# EAGLE schematic SBC_rev 3 (EAGLE 8.5.0)
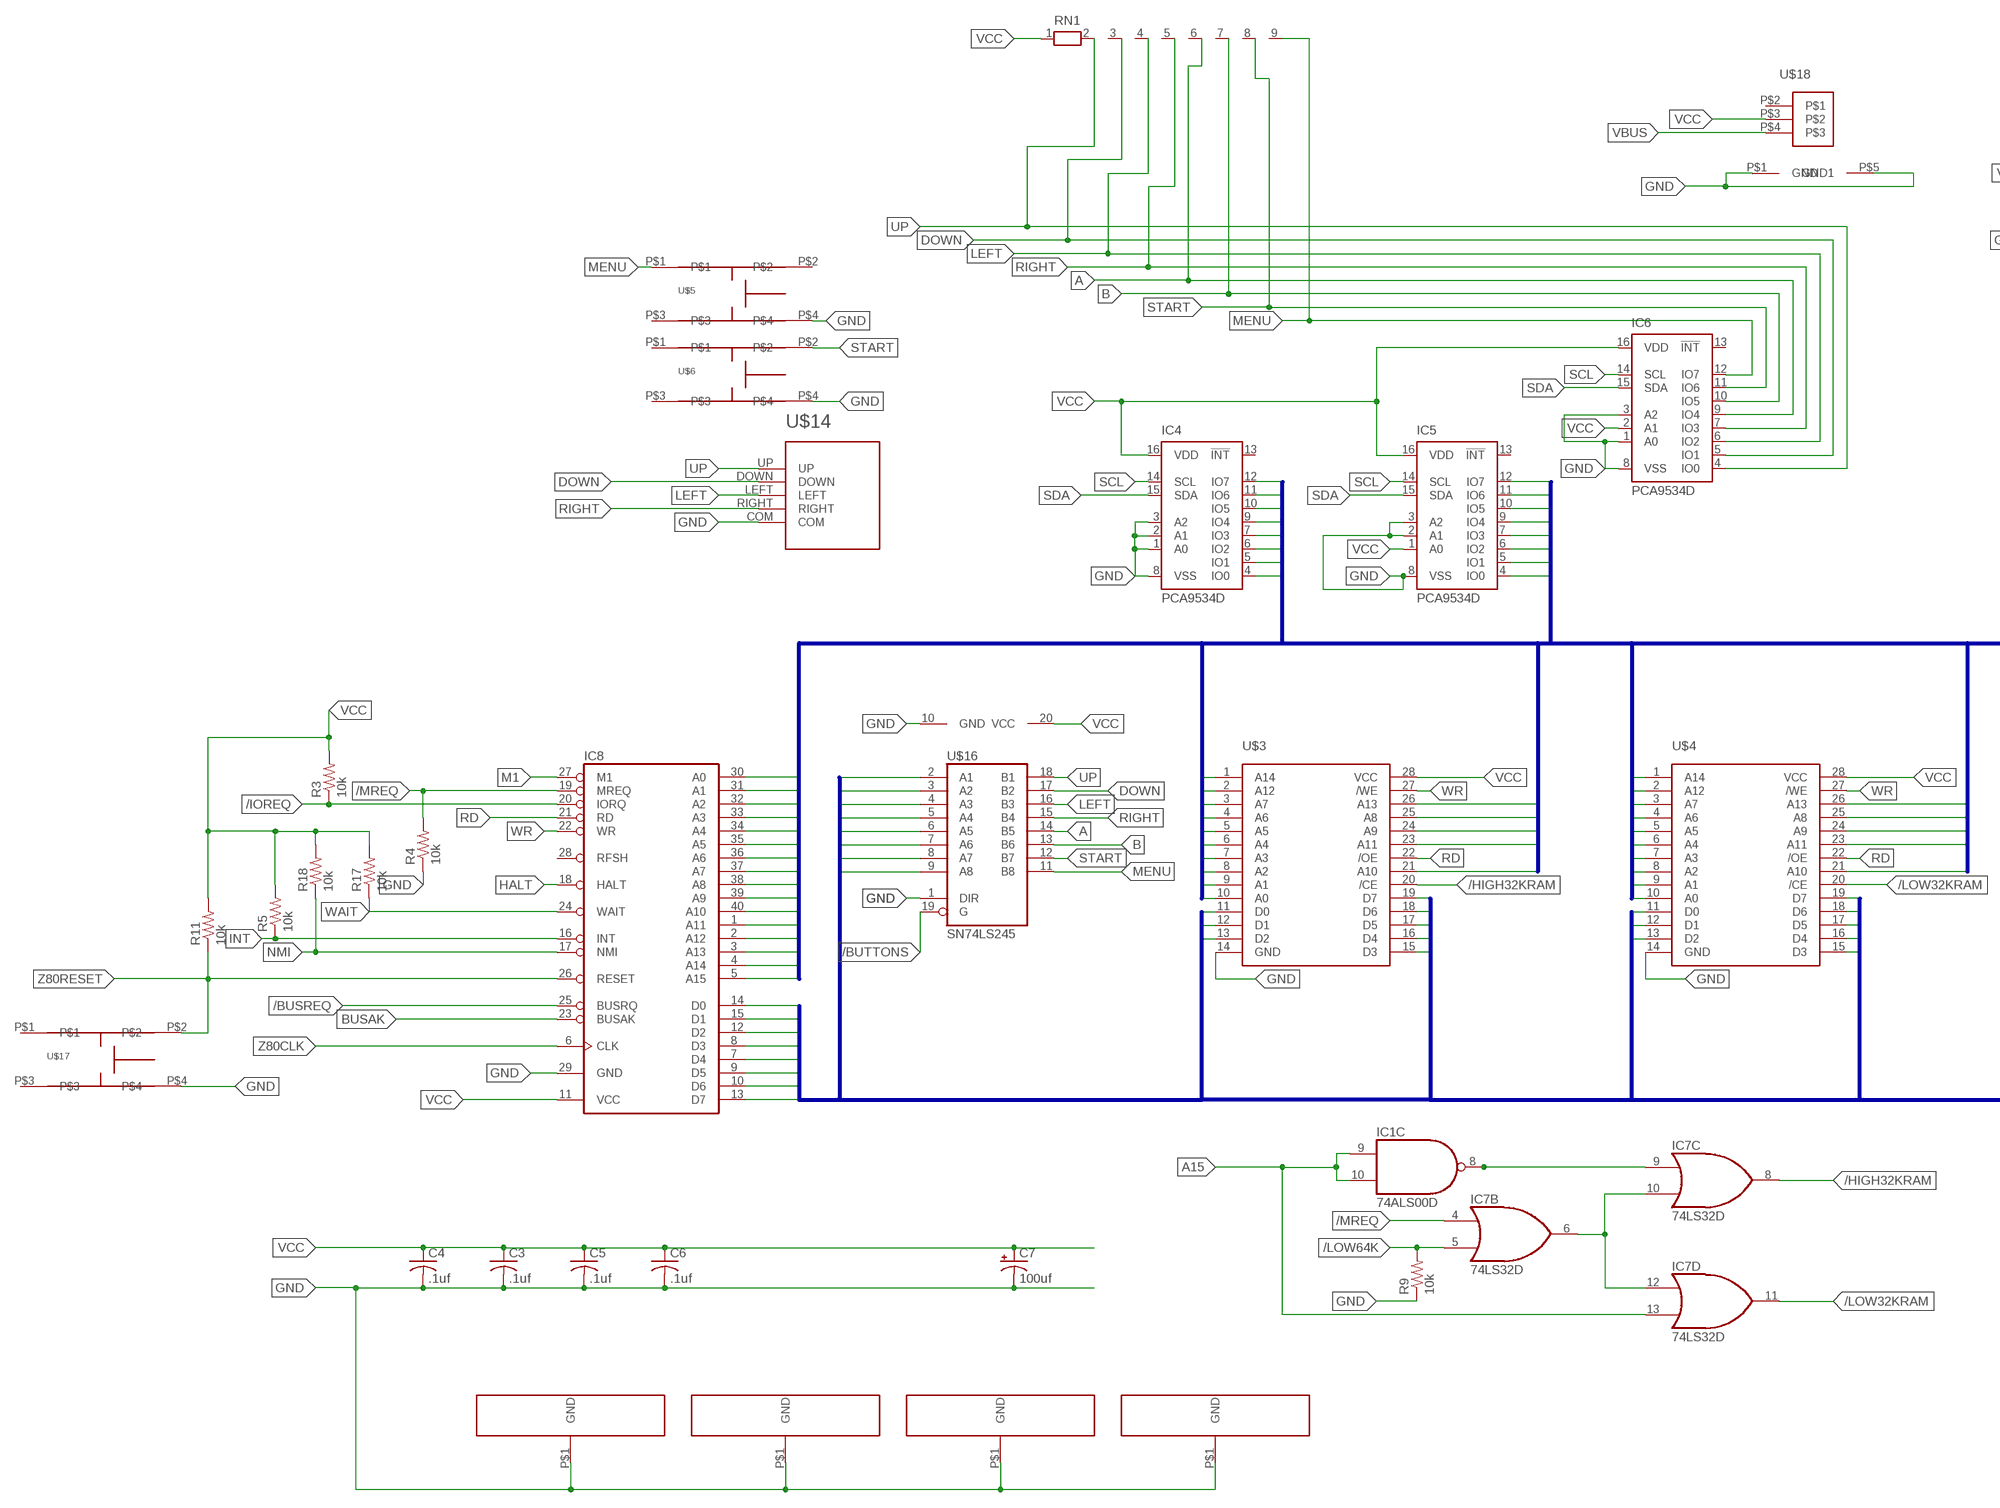
[diagram p0: schematic, sheet 1, part 1 of 2]
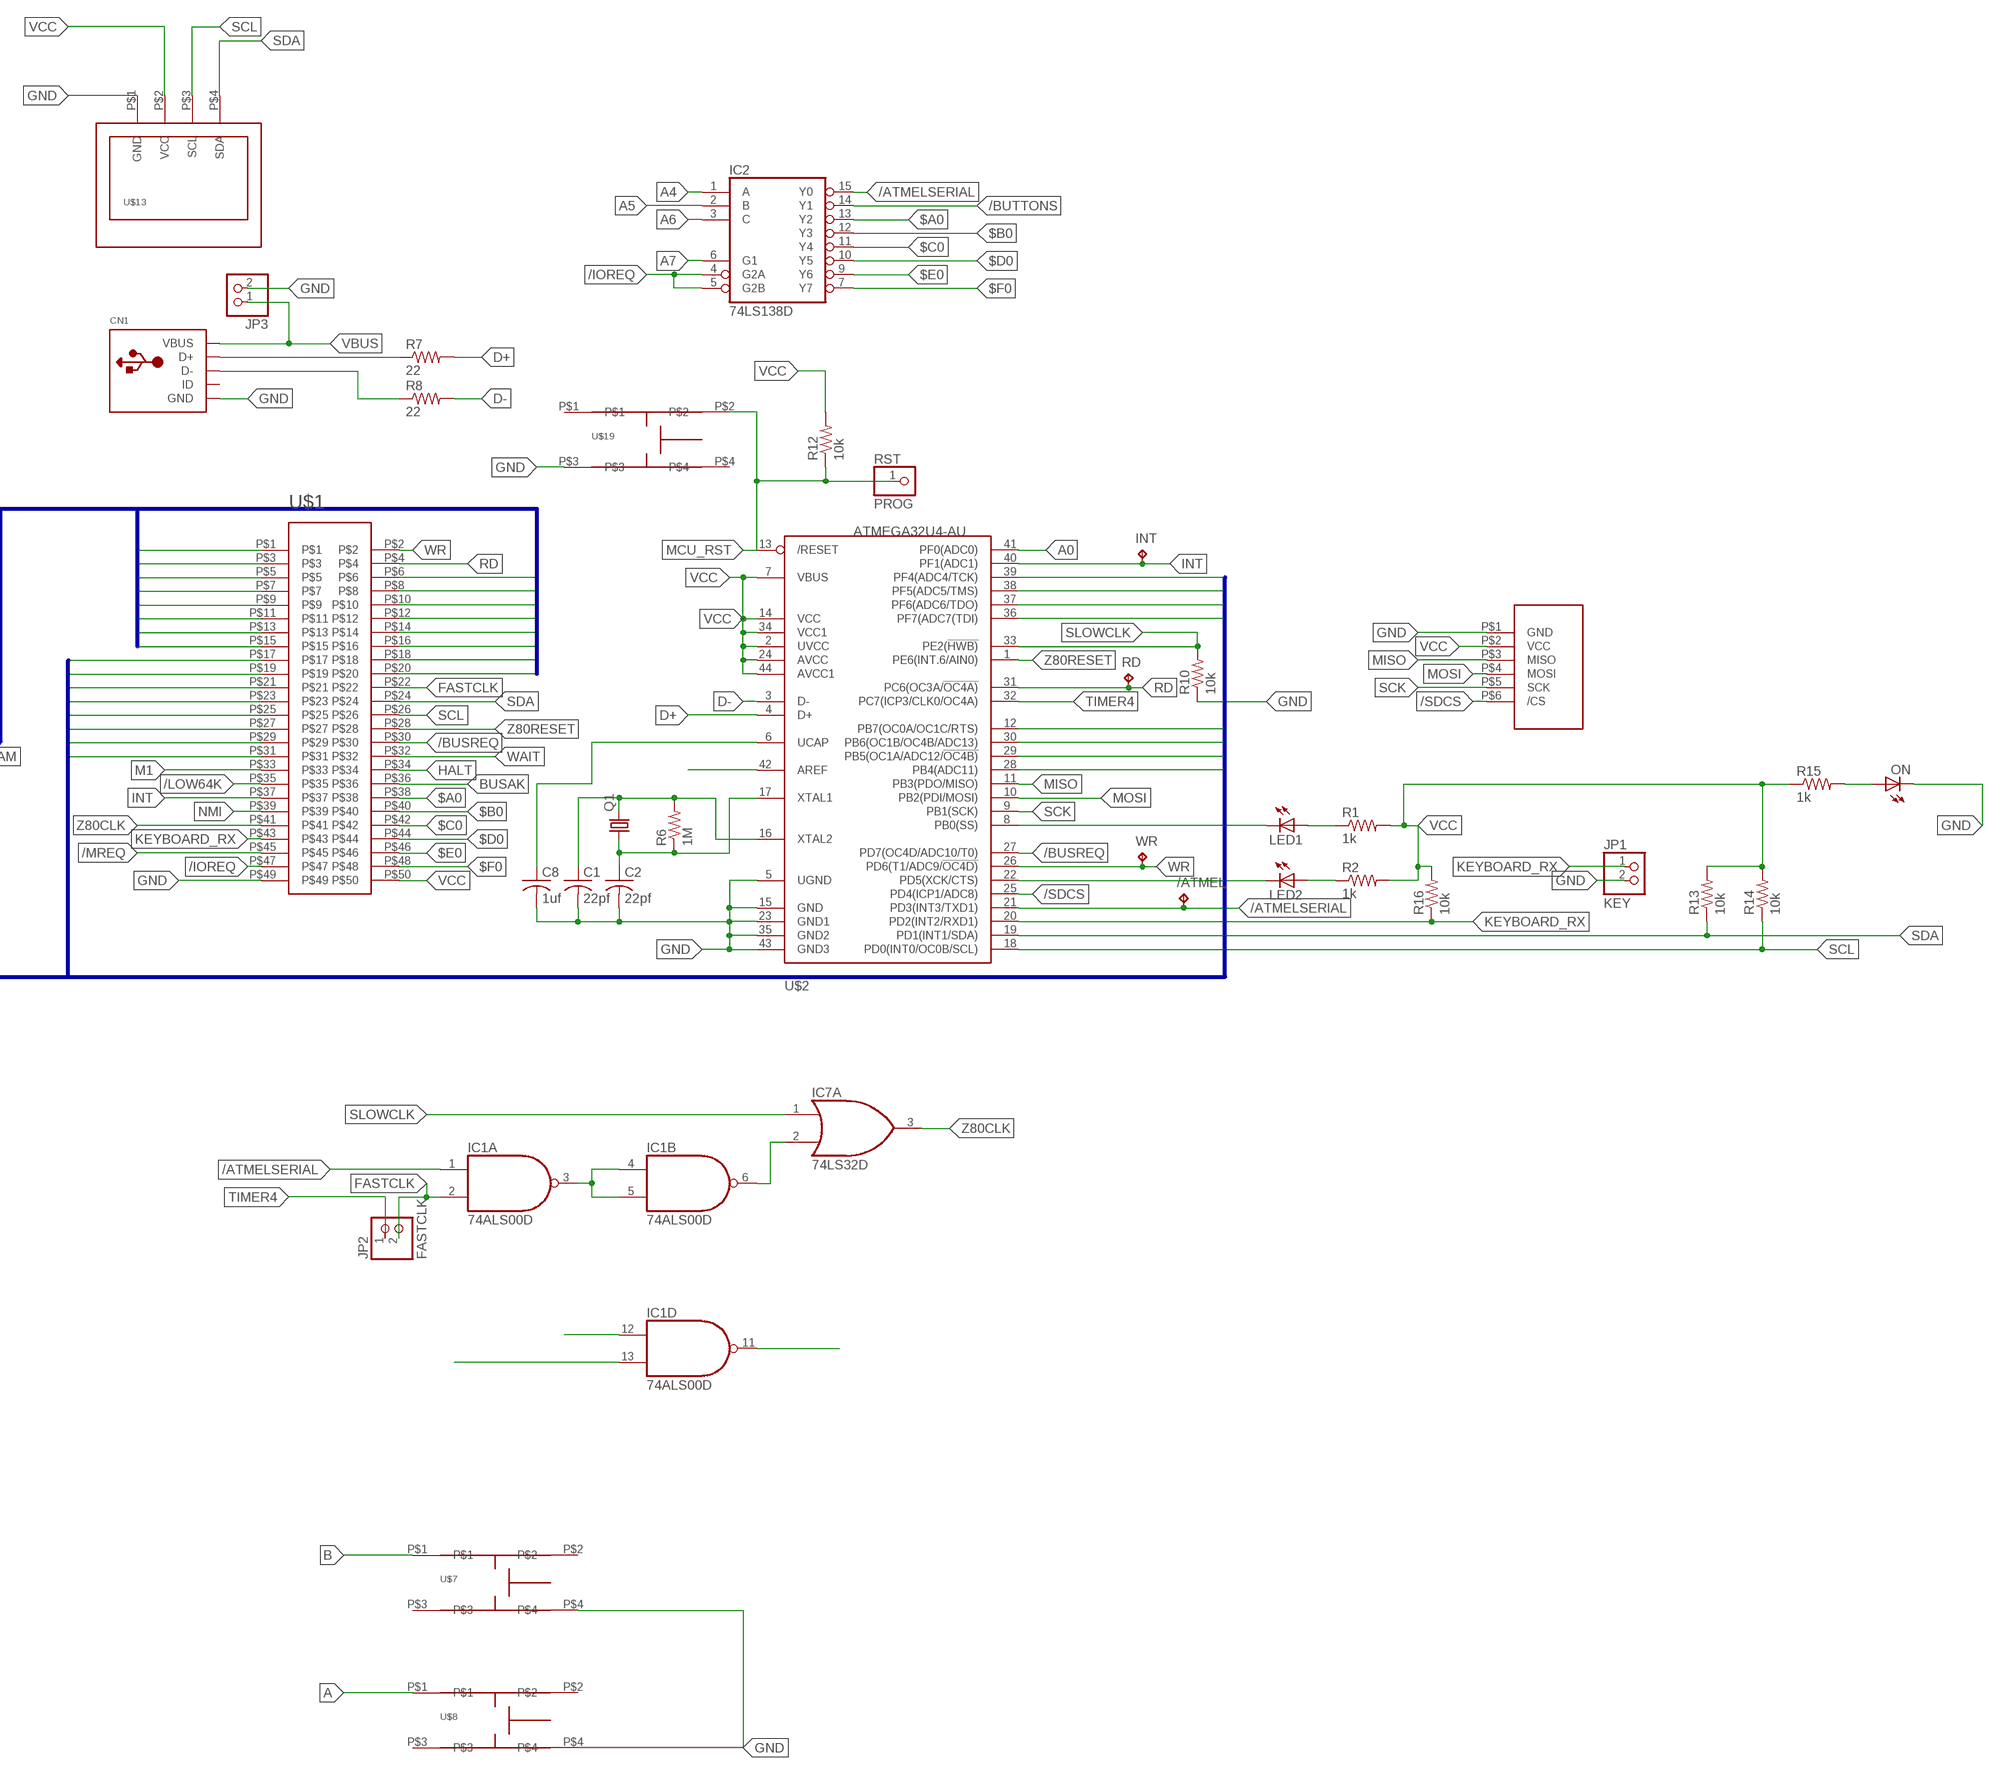
[diagram p1: schematic, sheet 1, part 2 of 2]

## Parts
/ATMEL  TPB1,27  [B1,27]
C1  22pf  RESISTOR_C-US025-024X044  [RESISTOR_C025-024X044]
C2  22pf  RESISTOR_C-US025-024X044  [RESISTOR_C025-024X044]
C3  .1uf  RESISTOR_C-US025-024X044  [RESISTOR_C025-024X044]
C4  .1uf  RESISTOR_C-US025-024X044  [RESISTOR_C025-024X044]
C5  .1uf  RESISTOR_C-US025-024X044  [RESISTOR_C025-024X044]
C6  .1uf  RESISTOR_C-US025-024X044  [RESISTOR_C025-024X044]
C7  100uf  CPOL-USE2.5-7  [E2,5-7]
C8  1uf  RESISTOR_C-US025-024X044  [RESISTOR_C025-024X044]
CN1  USBMOLEX  [USB-MINIB-THM-MOLEX]
IC1  74ALS00D  [SO14]
IC2  74LS138D  [SO16]
IC4  PCA9534D  [SO16W]
IC5  PCA9534D  [SO16W]
IC6  PCA9534D  [SO16W]
IC7  74LS32D  [SO14]
IC8  Z80CPU  [DIL40]
INT  TPB1,27  [B1,27]
JP1  KEY  PINHD-1X2  [1X02]
JP2  FASTCLK  PINHD-1X2/90  [1X02/90]
JP3  PINHD-1X2/90  [1X02/90]
LED1  LED3MM  [LED3MM]
LED2  LED3MM  [LED3MM]
ON  LED3MM  [LED3MM]
Q1  CRYSTALHC49S  [HC49/S]
R1  1k  R-US_R1206  [R1206]
R2  1k  R-US_R1206  [R1206]
R3  10k  R-US_R1206  [R1206]
R4  10k  R-US_R1206  [R1206]
R5  10k  R-US_R1206  [R1206]
R6  1M  R-US_R1206  [R1206]
R7  22  R-US_R1206  [R1206]
R8  22  R-US_R1206  [R1206]
R9  10k  R-US_R1206  [R1206]
R10  10k  R-US_R1206  [R1206]
R11  10k  R-US_R1206  [R1206]
R12  10k  R-US_R1206  [R1206]
R13  10k  R-US_R1206  [R1206]
R14  10k  R-US_R1206  [R1206]
R15  1k  R-US_R1206  [R1206]
R16  10k  R-US_R1206  [R1206]
R17  10k  R-US_R1206  [R1206]
R18  10k  R-US_R1206  [R1206]
RD  TPB1,27  [B1,27]
RN1  RN08  [RN-9]
RST  PROG  PINHD-1X1  [1X01]
SD_ADAPTER  SD_ADAPTER  [SD_RIGHTANGLE]
U$1  CARDSLOT50  [CARD50]
U$2  ATMEGA32U4-AU  [TQFP44]
U$3  IS65C256AL_32KRAM  [SO28-3]
U$4  IS65C256AL_32KRAM  [SO28-3]
U$5  TACT  [6MM_TACT]
U$6  TACT  [6MM_TACT]
U$7  TACT  [6MM_TACT]
U$8  TACT  [6MM_TACT]
U$9  GND_STRIP  [GND_PADS]
U$10  GND_STRIP  [GND_PADS]
U$11  GND_STRIP  [GND_PADS]
U$12  GND_STRIP  [GND_PADS]
U$13  OLED_SSD1306_I2C  [OLED_128X64_I2C]
U$14  SKQUCAA010  [SKQUCAA010]
U$16  SN74LS245  [SO20L]
U$17  TACT  [6MM_TACT]
U$18  SWITCH_1825232-1  [SWITCH]
U$19  TACT  [6MM_TACT]
WR  TPB1,27  [B1,27]

## Nets
$A0: IC2.13(Y2) U$1.P$38
$B0: IC2.12(Y3) U$1.P$40
$C0: IC2.11(Y4) U$1.P$42
$D0: IC2.10(Y5) U$1.P$44
$E0: IC2.9(Y6) U$1.P$46
$F0: IC2.7(Y7) U$1.P$48
/ATMELSERIAL: /ATMEL.TP IC1.1(A:I0) IC2.15(Y0) U$2.21(PD3(INT3/TXD1))
/BUSREQ: IC8.25(BUSRQ) U$1.P$30 U$2.27(PD7(OC4D/ADC10/T0))
/BUTTONS: IC2.14(Y1) U$16.19(G)
/HIGH32KRAM: IC7.8(C:O) U$3.20(/CE)
/IOREQ: IC2.4(G2A) IC2.5(G2B) IC8.20(IORQ) R3.1 U$1.P$47
/LOW32KRAM: IC7.11(D:O) U$4.20(/CE)
/LOW64K: IC7.5(B:I1) R9.2 U$1.P$35
/MREQ: IC7.4(B:I0) IC8.19(MREQ) R4.2 U$1.P$45
/SDCS: SD_ADAPTER.P$6(/CS) U$2.25(PD4(ICP1/ADC8))
A: IC6.9(IO4) RN1.6 U$8.P$1 U$16.14(B5)
A0: IC4.4(IO0) IC8.30(A0) U$1.P$15 U$2.41(PF0(ADC0)) U$3.10(A0) U$4.10(A0)
A1: IC4.5(IO1) IC8.31(A1) U$1.P$13 U$3.9(A1) U$4.9(A1)
A2: IC4.6(IO2) IC8.32(A2) U$1.P$11 U$3.8(A2) U$4.8(A2)
A3: IC4.7(IO3) IC8.33(A3) U$1.P$9 U$3.7(A3) U$4.7(A3)
A4: IC2.1(A) IC4.9(IO4) IC8.34(A4) U$1.P$7 U$3.6(A4) U$4.6(A4)
A5: IC2.2(B) IC4.10(IO5) IC8.35(A5) U$1.P$5 U$3.5(A5) U$4.5(A5)
A6: IC2.3(C) IC4.11(IO6) IC8.36(A6) U$1.P$3 U$3.4(A6) U$4.4(A6)
A7: IC2.6(G1) IC4.12(IO7) IC8.37(A7) U$1.P$1 U$3.3(A7) U$4.3(A7)
A8: IC5.4(IO0) IC8.38(A8) U$1.P$6 U$3.25(A8) U$4.25(A8)
A9: IC5.5(IO1) IC8.39(A9) U$1.P$8 U$3.24(A9) U$4.24(A9)
A10: IC5.6(IO2) IC8.40(A10) U$1.P$10 U$3.21(A10) U$4.21(A10)
A11: IC5.7(IO3) IC8.1(A11) U$1.P$12 U$3.23(A11) U$4.23(A11)
A12: IC5.9(IO4) IC8.2(A12) U$1.P$14 U$3.2(A12) U$4.2(A12)
A13: IC5.10(IO5) IC8.3(A13) U$1.P$16 U$3.26(A13) U$4.26(A13)
A14: IC5.11(IO6) IC8.4(A14) U$1.P$18 U$3.1(A14) U$4.1(A14)
A15: IC1.9(C:I0) IC1.10(C:I1) IC5.12(IO7) IC7.13(D:I1) IC8.5(A15) U$1.P$20
AREF: U$2.42(AREF)
B: IC6.10(IO5) RN1.7 U$7.P$1 U$16.13(B6)
BUSAK: IC8.23(BUSAK) U$1.P$36
D0: IC8.14(D0) U$1.P$17 U$2.39(PF4(ADC4/TCK)) U$3.11(D0) U$4.11(D0) U$16.2(A1)
D1: IC8.15(D1) U$1.P$19 U$2.38(PF5(ADC5/TMS)) U$3.12(D1) U$4.12(D1) U$16.3(A2)
D2: IC8.12(D2) U$1.P$21 U$2.37(PF6(ADC6/TDO)) U$3.13(D2) U$4.13(D2) U$16.4(A3)
D3: IC8.8(D3) U$1.P$23 U$2.36(PF7(ADC7(TDI)) U$3.15(D3) U$4.15(D3) U$16.5(A4)
D4: IC8.7(D4) U$1.P$25 U$2.28(PB4(ADC11)) U$3.16(D4) U$4.16(D4) U$16.6(A5)
D5: IC8.9(D5) U$1.P$27 U$2.29(PB5(OC1A/ADC12/!OC4B)) U$3.17(D5) U$4.17(D5) U$16.7(A6)
D6: IC8.10(D6) U$1.P$29 U$2.30(PB6(OC1B/OC4B/ADC13)) U$3.18(D6) U$4.18(D6) U$16.8(A7)
D7: IC8.13(D7) U$1.P$31 U$2.12(PB7(OC0A/OC1C/RTS)) U$3.19(D7) U$4.19(D7) U$16.9(A8)
D+: R7.2 U$2.4(D+)
D-: R8.2 U$2.3(D-)
DOWN: IC6.5(IO1) RN1.3 U$14.DOWN U$16.17(B2)
FASTCLK: IC1.2(A:I1) JP2.2 U$1.P$22
GND: C1.2 C2.2 C3.2 C4.2 C5.2 C6.2 C7.- C8.2 CN1.GND IC4.1(A0) IC4.2(A1) IC4.3(A2) IC4.8(VSS) IC5.2(A1) IC5.3(A2) IC5.8(VSS) IC6.1(A0) IC6.3(A2) IC6.8(VSS) IC8.29(GND) JP1.2 JP3.2 ON.K(C) R4.1 R9.1 R10.1 SD_ADAPTER.P$1(GND) U$1.P$49 U$2.5(UGND) U$2.15(GND) U$2.23(GND1) U$2.35(GND2) U$2.43(GND3) U$3.14(GND) U$4.14(GND) U$5.P$4 U$6.P$4 U$7.P$4 U$8.P$4 U$9.P$1(GND) U$10.P$1(GND) U$11.P$1(GND) U$12.P$1(GND) U$13.P$1(GND) U$14.COM U$16.1(DIR) U$16.10(GND) U$17.P$4 U$18.P$1(GND) U$18.P$5(GND1) U$19.P$3
HALT: IC8.18(HALT) U$1.P$34
INT: IC8.16(INT) INT.TP R5.1 U$1.P$37 U$2.40(PF1(ADC1))
KEYBOARD_RX: JP1.1 R16.1 U$1.P$43 U$2.20(PD2(INT2/RXD1))
LED1: LED1.K(C) U$2.8(PB0(SS))
LED2: LED2.K(C) U$2.22(PD5(XCK/CTS))
LEFT: IC6.6(IO2) RN1.4 U$14.LEFT U$16.16(B3)
M1: IC8.27(M1) U$1.P$33
MCU_RST: R12.1 RST.1 U$2.13(/RESET) U$19.P$2
MENU: IC6.12(IO7) RN1.9 U$5.P$1 U$16.11(B8)
MISO: SD_ADAPTER.P$3(MISO) U$2.11(PB3(PDO/MISO))
MOSI: SD_ADAPTER.P$4(MOSI) U$2.10(PB2(PDI/MOSI))
N$1: IC1.12(D:I0)
N$2: IC1.13(D:I1)
N$4: C1.1 Q1.2 R6.2 U$2.16(XTAL2)
N$5: C2.1 Q1.1 R6.1 U$2.17(XTAL1)
N$6: IC1.11(D:O)
N$7: ON.A R15.2
N$16: IC1.3(A:O) IC1.4(B:I0) IC1.5(B:I1)
N$28: LED1.A R1.1
N$39: IC1.6(B:O) IC7.2(A:I1)
N$41: IC7.6(B:O) IC7.10(C:I1) IC7.12(D:I0)
N$45: LED2.A R2.1
N$52: IC1.8(C:O) IC7.9(C:I0)
N$55: CN1.D+ R7.1
N$56: CN1.D- R8.1
NMI: IC8.17(NMI) R18.1 U$1.P$39
RD: IC8.21(RD) RD.TP U$1.P$4 U$2.31(PC6(OC3A/!OC4A)) U$3.22(/OE) U$4.22(/OE)
RIGHT: IC6.7(IO3) RN1.5 U$14.RIGHT U$16.15(B4)
SCK: SD_ADAPTER.P$5(SCK) U$2.9(PB1(SCK))
SCL: IC4.14(SCL) IC5.14(SCL) IC6.14(SCL) R14.1 U$1.P$26 U$2.18(PD0(INT0/OC0B/SCL)) U$13.P$3(SCL)
SDA: IC4.15(SDA) IC5.15(SDA) IC6.15(SDA) R13.1 U$1.P$24 U$2.19(PD1(INT1/SDA)) U$13.P$4(SDA)
SLOWCLK: IC7.1(A:I0) R10.2 U$2.33(PE2(!HWB))
START: IC6.11(IO6) RN1.8 U$6.P$2 U$16.12(B7)
TIMER4: JP2.1 U$2.32(PC7(ICP3/CLK0/OC4A))
UCAP: C8.1 U$2.6(UCAP)
UP: IC6.4(IO0) RN1.2 U$14.UP U$16.18(B1)
VBUS: CN1.VBUS JP3.1 U$18.P$4
VCC: C3.1 C4.1 C5.1 C6.1 C7.+ IC4.16(VDD) IC5.1(A0) IC5.16(VDD) IC6.2(A1) IC6.16(VDD) IC8.11(VCC) R1.2 R2.2 R3.2 R5.2 R11.2 R12.2 R13.2 R14.2 R15.1 R16.2 R17.2 R18.2 RN1.1 SD_ADAPTER.P$2(VCC) U$1.P$50 U$2.2(UVCC) U$2.7(VBUS) U$2.14(VCC) U$2.24(AVCC) U$2.34(VCC1) U$2.44(AVCC1) U$3.28(VCC) U$4.28(VCC) U$13.P$2(VCC) U$16.20(VCC) U$18.P$3
WAIT: IC8.24(WAIT) R17.1 U$1.P$32
WR: IC8.22(WR) U$1.P$2 U$2.26(PD6(T1/ADC9/!OC4D)) U$3.27(/WE) U$4.27(/WE) WR.TP
Z80CLK: IC7.3(A:O) IC8.6(CLK) U$1.P$41
Z80RESET: IC8.26(RESET) R11.1 U$1.P$28 U$2.1(PE6(INT.6/AIN0)) U$17.P$2
Unconnected: CN1.ID IC4.13(!INT) IC5.13(!INT) IC6.13(!INT) IC8.28(RFSH) U$5.P$2 U$5.P$3 U$6.P$1 U$6.P$3 U$7.P$2 U$7.P$3 U$8.P$2 U$8.P$3 U$17.P$1 U$17.P$3 U$18.P$2 U$19.P$1 U$19.P$4

## Buses
A[0..15]
D[0..7]

## Power pins joined to a net without a drawn wire
GND: IC1.7(P:GND) IC2.8(GND) IC7.7(P:GND)
VCC: IC1.14(P:VCC) IC2.16(VCC) IC7.14(P:VCC)

## Library data of the parts
/ATMEL INT RD WR = testpad:TP: Test pad
C1-C6 C8 = zx_kit2:RESISTOR_C-US: CAPACITOR, American symbol
C7 = adafruit:CPOL-US: POLARIZED CAPACITOR, American symbol
CN1 = adafruit:USB: USB Connectors USBMINIB - Surface Mount Female Mini-B USB Connector 4UConnector: 06564 By microbuilder.eu Thru-hole RA Female Mini-B USB Connector 4UConnector: 18732 By ladyada.net
IC1 = 74xx-us:74*00: Quad 2-input NAND gate
IC2 = 74xx-us:74*138: 3-line to 8-line DECODER/DEMULTIPLEXER
IC4-IC6 = micro-philips:PCA9534: 8-bit I2C-bus and SMBus low power I/O port with interrupt Source: www.nxp.com .. PCA9534_3.pdf; MPN: PCA9534DB; OC_FARNELL: 1408284; OC_NEWARK: 18M7513
IC7 = 74xx-us:74*32: Quad 2-input OR gate
IC8 = zilog:Z80CPU: Z80 FAMILY DEVICE
JP1-JP3 = pinhead:PINHD-1X2: PIN HEADER
LED1 LED2 ON = adafruit:LED: LED OSRAM: - CHIPLED LG R971, LG N971, LY N971, LG Q971, LY Q971, LO R971, LY R971 LH N974, LH R974 LS Q976, LO Q976, LY Q976 LO Q996 - Hyper CHIPLED LW Q18S LB Q993, LB Q99A, LB R99A - SideLED LS A670, LO A670, LY A670, LG A670, LP A670 LB A673, LV A673, LT A673, LW A673 LH A674 LY A675 LS A676, LA A676, LO A676, LY A676, LW A676 LS A679, LY A679, LG A679 - Hyper Micro SIDELED® LS Y876, LA Y876, LO Y876, LY Y876 LT Y87S - SmartLED LW L88C, LW L88S LB L89C, LB L89S, LG L890 LS L89K, LO L89K, LY L89K LS L896, LA L896, LO L896, LY L896 - TOPLED LS T670, LO T670, LY T670, LG T670, LP T670 LSG T670, LSP T670, LSY T670, LOP T670, LYG T670 LG T671, LOG T671, LSG T671 LB T673, LV T673, LT T673, LW T673 LH T674 LS T676, LA T676, LO T676, LY T676, LB T676, LH T676, LSB T676, LW T676 LB T67C, LV T67C, LT T67C, LS T67K, LO T67K, LY T67K, LW E67C LS E67B, LA E67B, LO E67B, LY E67B, LB E67C, LV E67C, LT E67C LW T67C LS T679, LY T679, LG T679 LS T770, LO T770, LY T770, LG T770, LP T770 LB T773, LV T773, LT T773, LW T773 LH T774 LS E675, LA E675, LY E675, LS T675 LS T776, LA T776, LO T776, LY T776, LB T776 LHGB T686 LT T68C, LB T68C - Hyper Mini TOPLED® LB M676 - Mini TOPLED Santana® LG M470 LS M47K, LO M47K, LY M47K Source: http://www.osram.convergy.de/
Q1 = crystal:CRYSTAL: CRYSTAL; OC_FARNELL: 1667008; OC_NEWARK: unknown
R1-R18 = rcl:R-US_: RESISTOR, American symbol; SPICEPREFIX: R
RN1 = resistor-net:RN08: RESISTOR NETWORK; OC_FARNELL: unknown; OC_NEWARK: unknown
RST = adafruit:PINHD-1X1: Pin header 1x1 for 0.1" spacing With round pins
SD_ADAPTER = OLED SSD1306 display:SD_ADAPTER
U$1 = 8-bit_computer:CARDSLOT50
U$2 = adafruit:ATMEGA32U4: http://www.ladyada.net/library/eagle
U$3 U$4 = 8-bit_computer:IS65C256AL_32KRAM
U$5-U$8 U$17 U$19 = atari_800:TACT
U$9-U$12 = Atari Vagabond:GND_STRIP
U$13 = OLED SSD1306 display:OLED_SSD1306_I2C
U$14 = OLED SSD1306 display:SKQUCAA010
U$16 = 8-bit_computer:SN74LS245
U$18 = 8-bit_computer:SWITCH_1825232-1